# EAGLE design v3 (EAGLE 7.7.0)
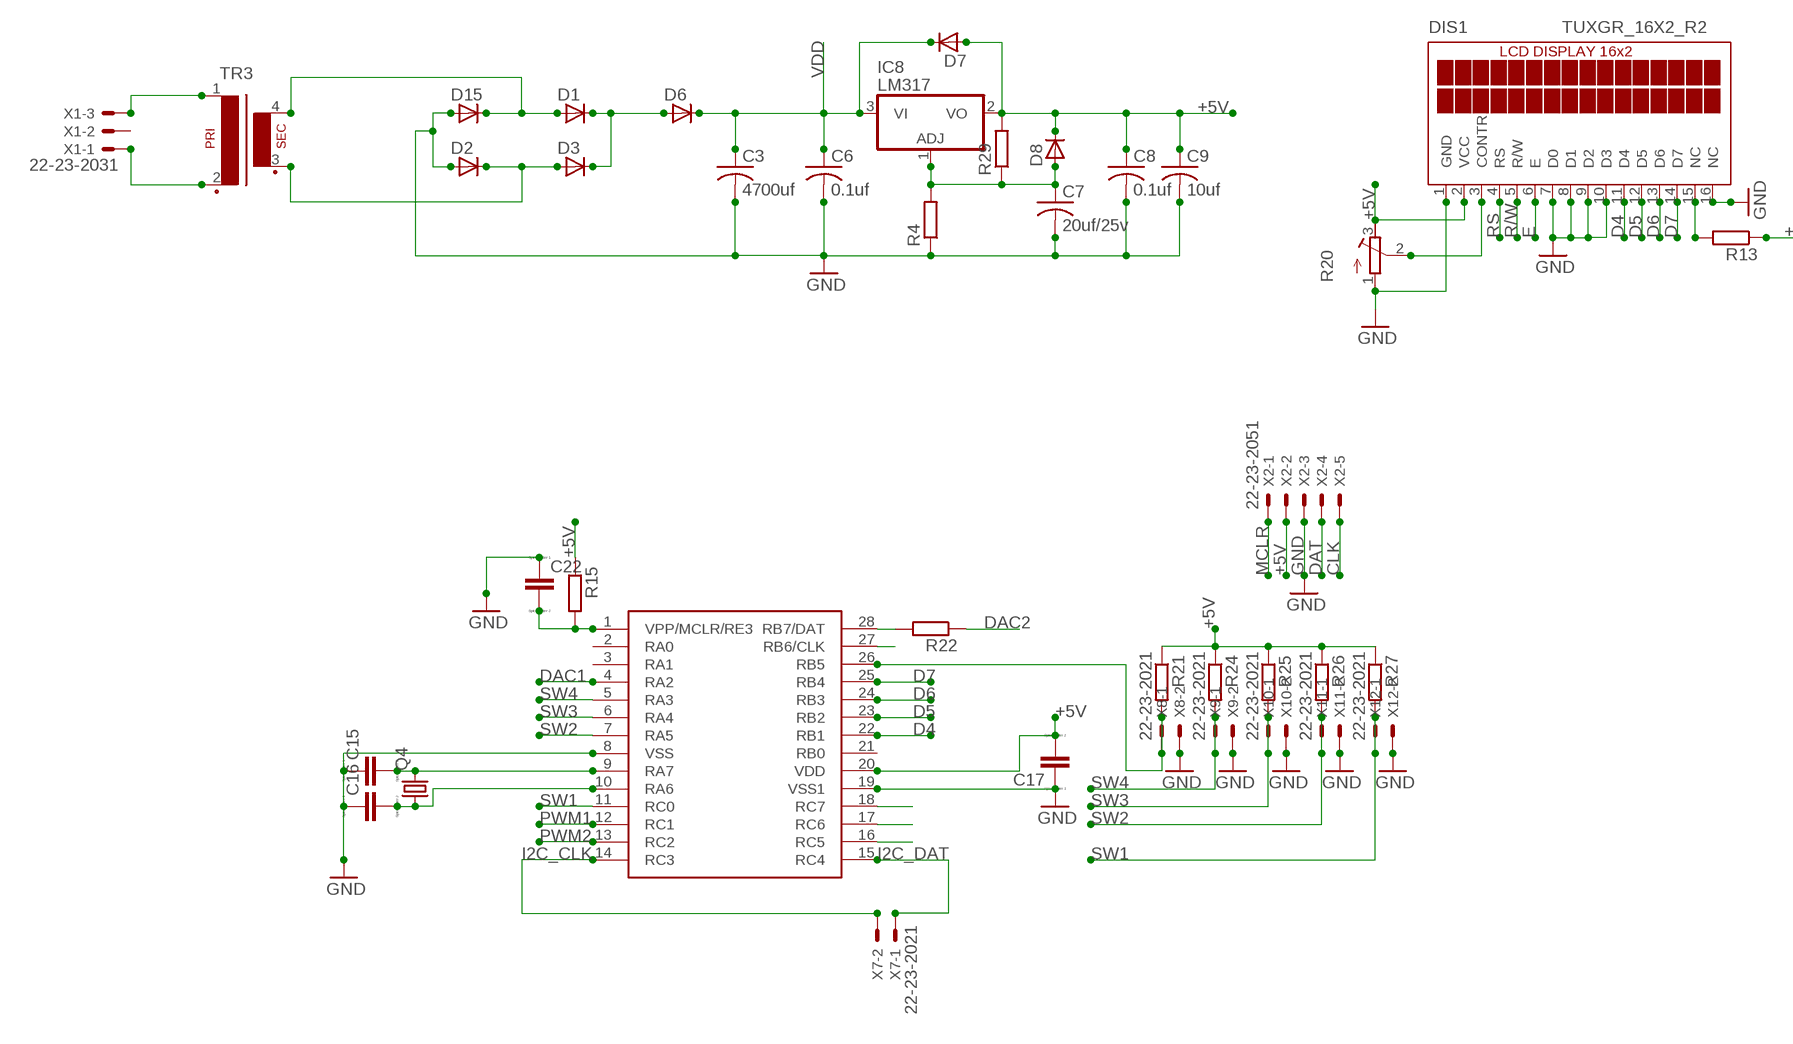
[diagram p0: schematic, sheet 1, part 1 of 2]
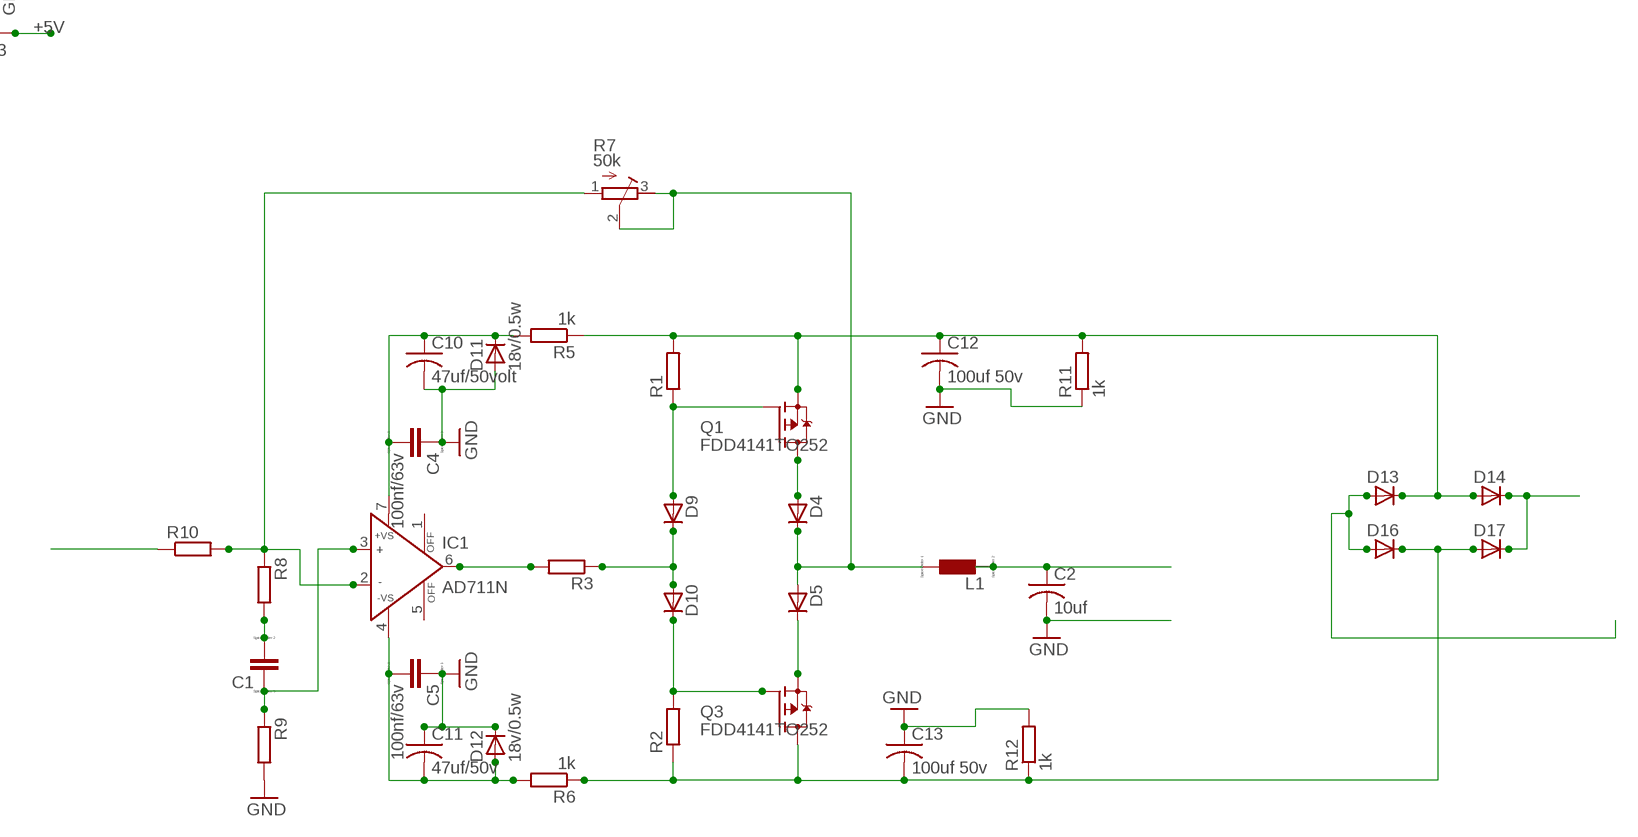
[diagram p1: schematic, sheet 1, part 2 of 2]

## Parts
C1  CC0603  [C0603]
C2  10uf  C-US025-025X050  [C025-025X050]
C3  4700uf  C-US025-025X050  [C025-025X050]
C4  100nf/63v  CC0603  [C0603]
C5  100nf/63v  CC0603  [C0603]
C6  0.1uf  C-US025-025X050  [C025-025X050]
C7  20uf/25v  C-US025-025X050  [C025-025X050]
C8  0.1uf  C-US025-025X050  [C025-025X050]
C9  10uf  C-US025-025X050  [C025-025X050]
C10  47uf/50volt  C-US025-025X050  [C025-025X050]
C11  47uf/50v  C-US025-025X050  [C025-025X050]
C12  100uf 50v  C-US025-025X050  [C025-025X050]
C13  100uf 50v  C-US025-025X050  [C025-025X050]
C15  CC0603  [C0603]
C16  CC0603  [C0603]
C17  CC0603  [C0603]
C22  CC0603  [C0603]
D1  D-SOD-87  [SOD87]
D2  D-SOD-87  [SOD87]
D3  D-SOD-87  [SOD87]
D4  D-SOD-87  [SOD87]
D5  D-SOD-87  [SOD87]
D6  D-SOD-87  [SOD87]
D7  D-SOD-87  [SOD87]
D8  D-SOD-87  [SOD87]
D9  D-SOD-87  [SOD87]
D10  D-SOD-87  [SOD87]
D11  18v/0.5w  D-SOD-87  [SOD87]
D12  18v/0.5w  D-SOD-87  [SOD87]
D13  D-SOD-87  [SOD87]
D14  D-SOD-87  [SOD87]
D15  D-SOD-87  [SOD87]
D16  D-SOD-87  [SOD87]
D17  D-SOD-87  [SOD87]
DIS1  TUXGR_16X2_R2  [TUXGR_16X2_R2]
IC1  AD711N  [DIL08]
IC8  LM317  78L05Z  [TO92]
L1  L0204/7  [0204/7]
Q1  FDD4141TO252  [TO252]
Q3  FDD4141TO252  [TO252]
Q4  CRYSTALHC49U-V  [HC49U-V]
R1  R-EU_R0603  [R0603]
R2  R-EU_R0603  [R0603]
R3  R-EU_R0603  [R0603]
R4  R-EU_R0603  [R0603]
R5  1k  R-EU_R0603  [R0603]
R6  1k  R-EU_R0603  [R0603]
R7  50k  R-TRIMM64X  [RTRIM64X]
R8  R-EU_R0603  [R0603]
R9  R-EU_R0603  [R0603]
R10  R-EU_R0603  [R0603]
R11  1k  R-EU_R0603  [R0603]
R12  1k  R-EU_R0603  [R0603]
R13  R-EU_R0603  [R0603]
R15  R-EU_R0603  [R0603]
R20  R-TRIMM64X  [RTRIM64X]
R21  R-EU_R0603  [R0603]
R22  R-EU_R0603  [R0603]
R24  R-EU_R0603  [R0603]
R25  R-EU_R0603  [R0603]
R26  R-EU_R0603  [R0603]
R27  R-EU_R0603  [R0603]
R29  R-EU_R0603  [R0603]
TR3  VR13-1  [VR13-1]
U$1  PIC16F15345  [SO28W]
X1  22-23-2031  [22-23-2031]
X2  22-23-2051  [22-23-2051]
X7  22-23-2021  [22-23-2021]
X8  22-23-2021  [22-23-2021]
X9  22-23-2021  [22-23-2021]
X10  22-23-2021  [22-23-2021]
X11  22-23-2021  [22-23-2021]
X12  22-23-2021  [22-23-2021]

## Nets
+5V: C8.1 C9.1 C17.2 D7.2(A) D8.1(C) DIS1.2(VCC) IC8.2(VO) R13.1 R15.1 R20.3(E) R21.1 R24.1 R25.1 R26.1 R27.1 R29.2 U$1.20(VDD) X2.2
CLK: U$1.27(RB6/CLK) X2.5
D4: DIS1.11(D4) U$1.22(RB1)
D5: DIS1.12(D5) U$1.23(RB2)
D6: DIS1.13(D6) U$1.24(RB3)
D7: DIS1.14(D7) U$1.25(RB4)
DAC1: U$1.4(RA2)
DAC2: R22.1
DAT: R22.2 U$1.28(RB7/DAT) X2.4
E: DIS1.6(E) U$1.18(RC7)
GND: C2.2 C3.2 C4.1 C5.1 C6.2 C7.2 C8.2 C9.2 C10.2 C11.1 C12.2 C13.1 C15.1 C16.1 C17.1 C22.1 D2.2(A) D11.2(A) D12.1(C) D15.2(A) DIS1.1(GND) DIS1.7(D0) DIS1.8(D1) DIS1.9(D2) DIS1.10(D3) DIS1.16(NC) R4.1 R9.2 R11.1 R12.2 R20.1(A) U$1.8(VSS) U$1.19(VSS1) X2.3 X8.2 X9.2 X10.2 X11.2 X12.2
GND1: D13.2(A) D16.2(A)
I2C_CLK: U$1.14(RC3) X7.2
I2C_DAT: U$1.15(RC4) X7.1
MCLR: C22.2 R15.2 U$1.1(VPP/MCLR/RE3) X2.1
N$1: D4.1(C) D5.2(A) L1.1 R7.2(S) R7.3(E)
N$2: D4.2(A) Q1.3(D)
N$3: D1.1(C) D3.1(C) D6.2(A)
N$4: D1.2(A) D15.1(C) TR3.4(S4)
N$5: D2.1(C) D3.2(A) TR3.3(S3)
N$6: D5.1(C) Q3.2(S)
N$7: D9.1(C) D10.2(A) R3.1
N$8: DIS1.15(NC) R13.2
N$9: D10.1(C) Q3.1(G) R2.2
N$10: C7.1 D8.2(A) IC8.1(ADJ) R4.2 R29.1
N$11: R21.2 U$1.26(RB5) X8.1
N$12: D9.2(A) Q1.1(G) R1.1
N$15: IC1.6(OUT) R3.2
N$16: C5.2 C11.2 D12.2(A) IC1.4(-VS) R6.2
N$17: C4.2 C10.1 D11.1(C) IC1.7(+VS) R5.2
N$18: DIS1.3(CONTR) R20.2(S)
N$20: C1.2 R8.2
N$21: R10.1
N$22: IC1.2(IN-) R7.1(A) R8.1 R10.2
N$23: C1.1 IC1.3(IN+) R9.1
N$24: C2.1 L1.2
N$27: D14.1(C) D17.1(C)
N$28: C12.1 D13.1(C) D14.2(A) Q1.2(S) R1.2 R5.1 R11.2
N$29: TR3.1 X1.3
N$30: TR3.2 X1.1
N$31: C16.2 Q4.1 U$1.10(RA6)
N$32: C15.2 Q4.2 U$1.9(RA7)
N$33: C13.2 D16.1(C) D17.2(A) Q3.3(D) R2.1 R6.1 R12.1
PWM1: U$1.12(RC1)
PWM2: U$1.13(RC2)
R/W: DIS1.5(R/W) U$1.17(RC6)
RS: DIS1.4(RS) U$1.16(RC5)
SW1: R27.2 U$1.11(RC0) X12.1
SW2: R26.2 U$1.7(RA5) X11.1
SW3: R25.2 U$1.6(RA4) X10.1
SW4: R24.2 U$1.5(RA3) X9.1
VDD: C3.1 C6.1 D6.1(C) D7.1(C) IC8.3(VI)
Unconnected: IC1.1(OFF) IC1.5(OFF) U$1.2(RA0) U$1.3(RA1) U$1.21(RB0) X1.2

## Library data of the parts
C1 C4 C5 C15-C17 C22 = eagle-ltspice:C: CAPACITOR, European symbol; SPICEMODEL: NONE; SPICEPREFIX: C
C2 C3 C6-C13 = rcl:C-US: CAPACITOR, American symbol
D1-D17 = semicon-smd-ipc:D-: DIODE unfilled
DIS1 = display-lcd:TUXGR_16X2_R2: Tuxgraphics LCD display 16x2 characters reflective, without background light Source: tuxgr_12x2_r2.pdf; OC_FARNELL: unknown; OC_NEWARK: unknown
IC1 = analog-devices:AD711: Precision, Low Cost, High Speed, BiFET Op Amp Source: http://www.analog.com/static/imported-files/data_sheets/AD711.pdf; MPN: AD711BQ; OC_FARNELL: 9604839; OC_NEWARK: 66F5826
IC8 = lm317:78*: Positive VOLTAGE REGULATOR Source: http://cache.national.com/ds/LM/LM78L05.pdf http://www.fairchildsemi.com/ds/LM/LM7805.pdf
L1 = eagle-ltspice:L: INDUCTOR, European symbol; SPICEMODEL: NONE; SPICEPREFIX: L
Q1 Q3 = transistor-fet:FDD4141: P-Channel PowerTrench® MOSFET Source: FDD4141.pdf
Q4 = crystal:CRYSTAL: CRYSTAL; OC_FARNELL: 1666969; OC_NEWARK: unknown
R1-R6 R8-R13 R15 R21 R22 R24-R27 R29 = rcl:R-EU_: RESISTOR, European symbol
R7 R20 = rcl:R-TRIMM: Trimm resistor
TR3 = trafo:VR13-1: TRANSFORMER 1 primary winding, 1 secondary winding, mounting holes BLOCK
U$1 = microchip:PIC16F15345
X1 = con-molex:22-23-2031: .100" (2.54mm) Center Header - 3 Pin; MF: MOLEX; MPN: 22-23-2031; OC_FARNELL: 1462950; OC_NEWARK: 30C0862
X2 = con-molex:22-23-2051: .100" (2.54mm) Center Header - 5 Pin; MF: MOLEX; MPN: 22-23-2051; OC_FARNELL: 1462952; OC_NEWARK: 38C9178
X7-X12 = con-molex:22-23-2021: .100" (2.54mm) Center Header - 2 Pin; MF: MOLEX; MPN: 22-23-2021; OC_FARNELL: 1462926; OC_NEWARK: 25C3832

## Board
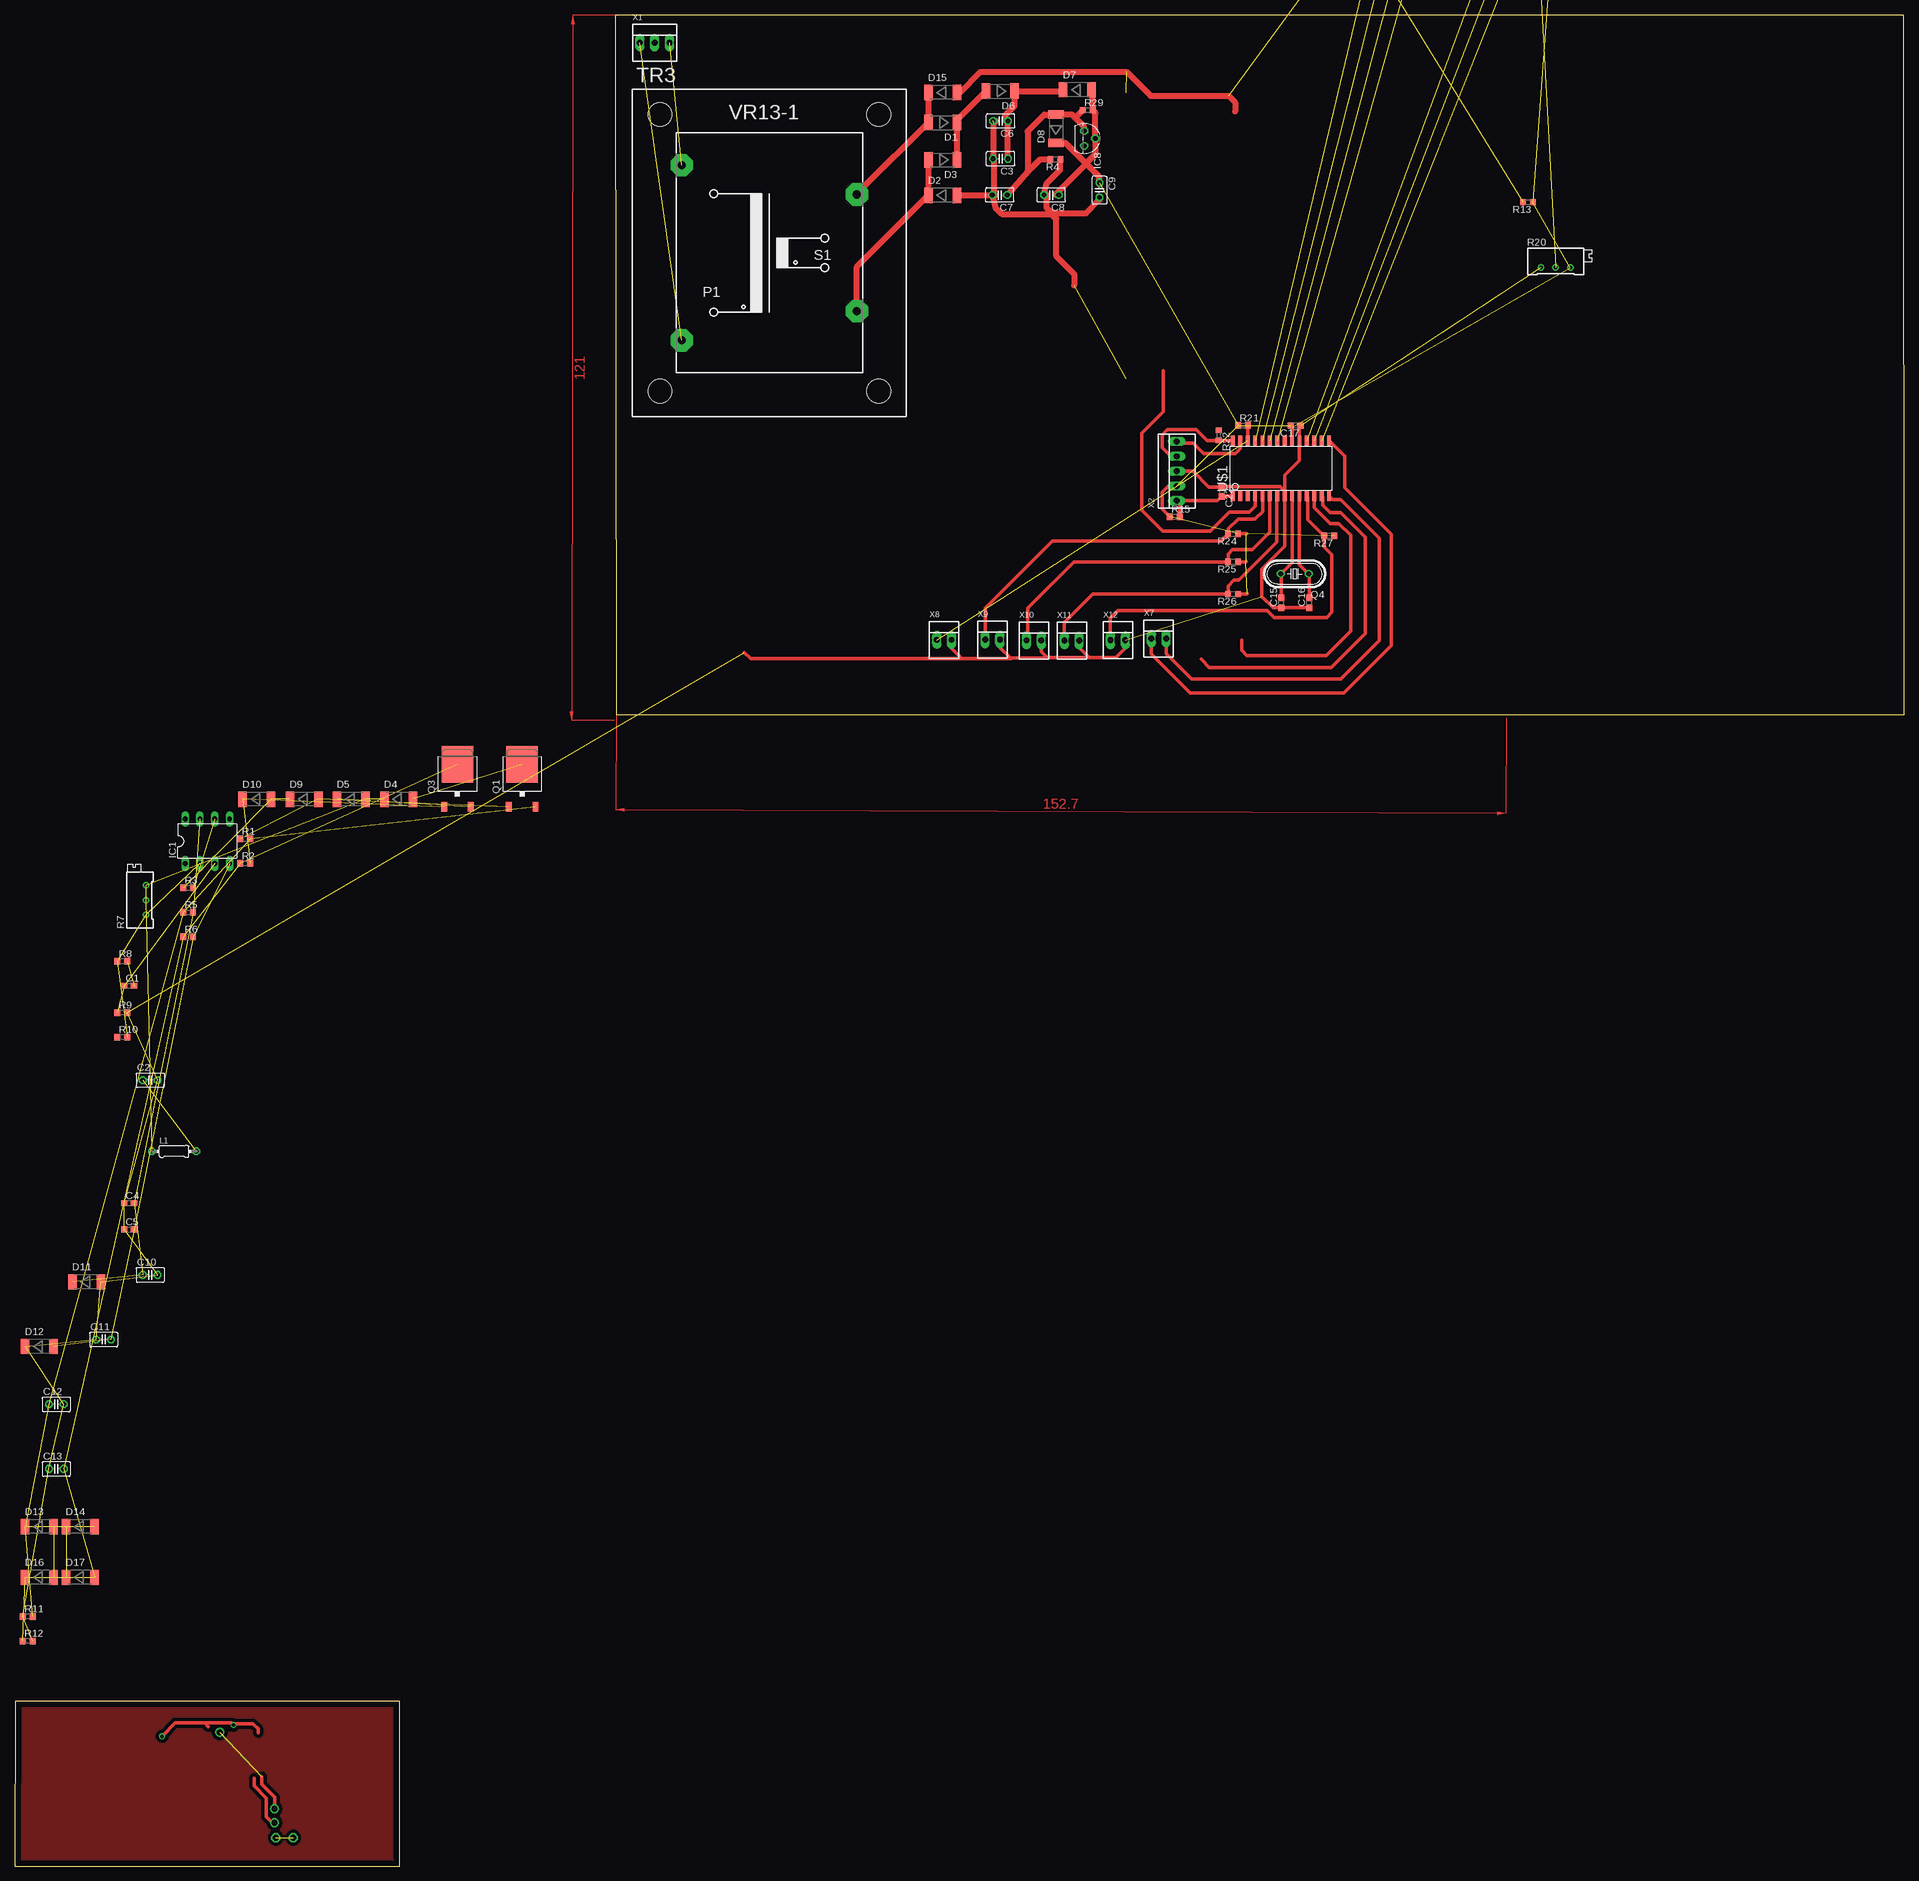
[diagram p2: board, top side]
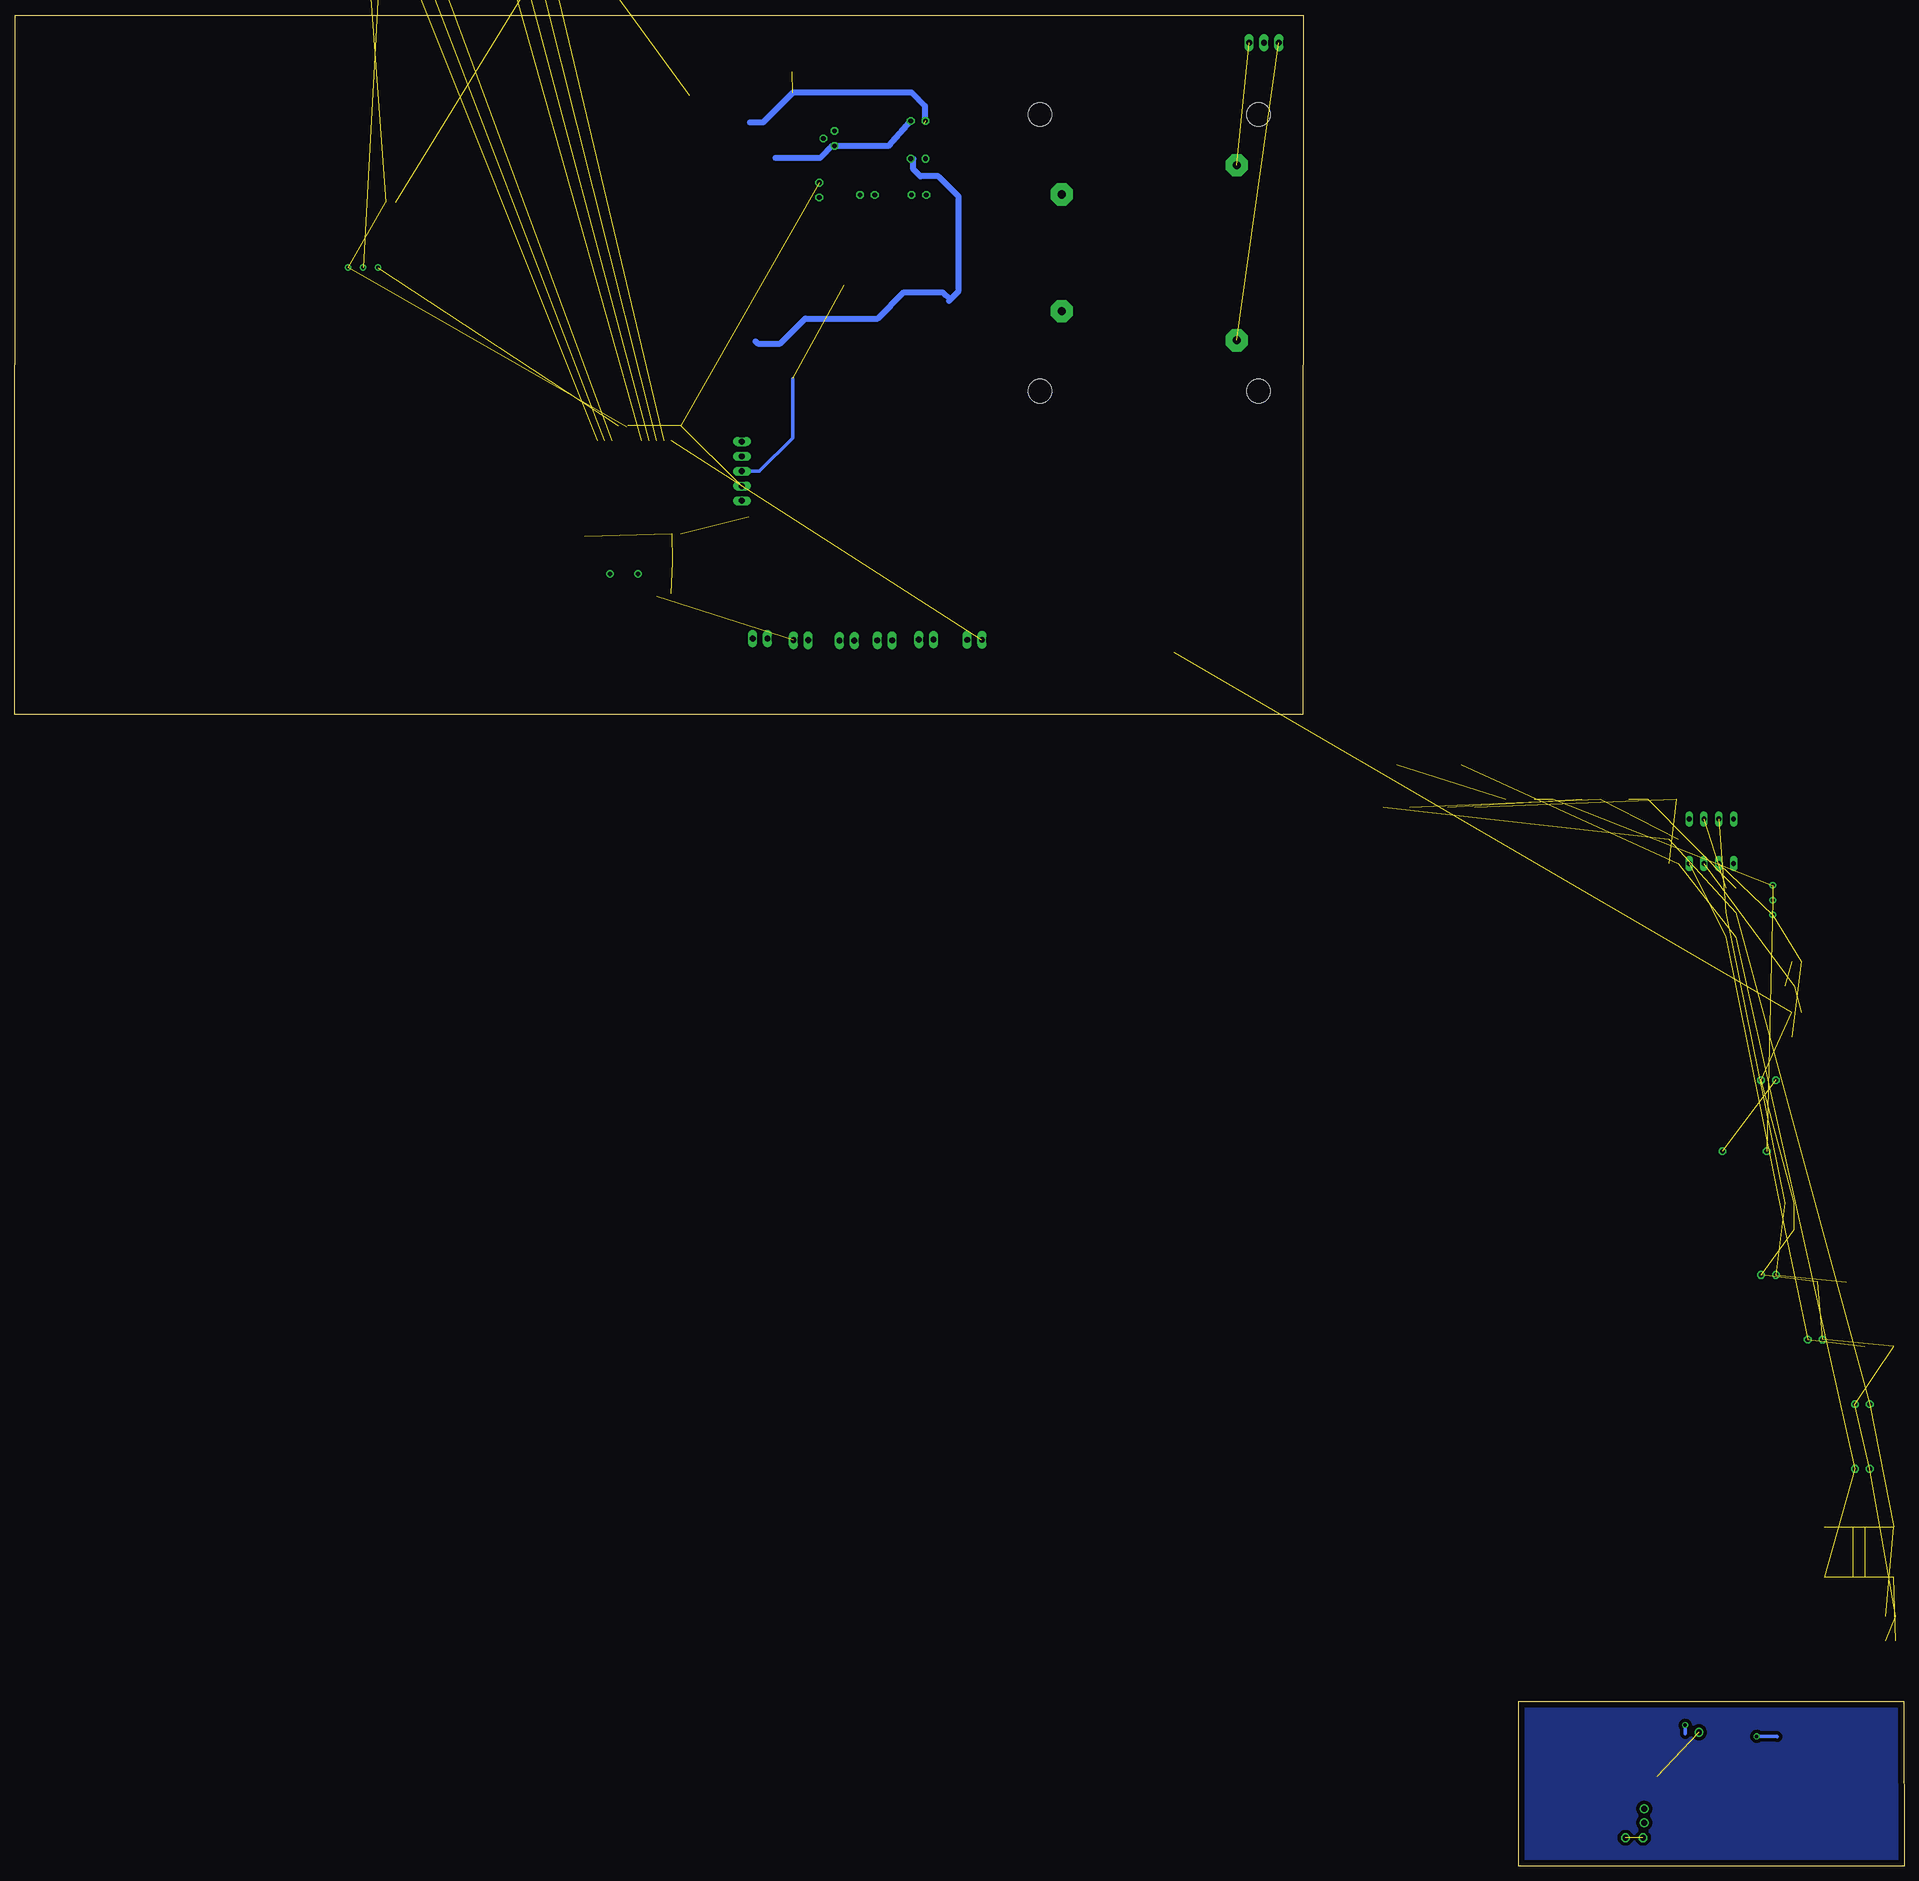
[diagram p3: board, bottom side, seen from below]

Size 324.13 x 317.6 mm. Coordinates in mm from the lower left corner, seen from the top.
Outline: 103.17,197.6 324.13,197.6 324.03,317.6 103.07,317.6 103.17,197.6
Outline: 0,0.06 66.1,0 66.1,28.3 0.1,28.3 0,0.06
Copper layers (1*16): Top 0.035mm / dielectric 1.5mm / Bottom 0.035mm
Design rules "default": minimum track width 10mil, minimum drill 24mil, track to track 8mil, track to pad 8mil, pad to pad 8mil, via to via 8mil, smd to smd 8mil, copper to edge 40mil, drill to drill 8mil, minimum pad ring 10mil, minimum via ring 8mil, stop-mask expansion 4mil, vias tented up to drill 0mil, thermal gap 10mil

### Footprints (pad centres in the part's own frame; a part is rotated, then mirrored left to right if it is on the bottom)
C0603 = smd 1.1 x 1: 1 -0.85,0; 2 0.85,0
C025-025X050 = drill 0.813 octagon: 1 -1.27,0; 2 1.27,0
SOD87 = smd 1.45 x 2.6: 1 -2.445,0; 2 2.445,0
TUXGR_16X2_R2 = drill 1 pad 1.676: 1 -32,15.5; 2 -29.46,15.5; 3 -26.92,15.5; 4 -24.38,15.5; 5 -21.84,15.5; 6 -19.3,15.5; 7 -16.76,15.5; 8 -14.22,15.5; 9 -11.68,15.5; 10 -9.14,15.5; 11 -6.6,15.5; 12 -4.06,15.5; 13 -1.52,15.5; 14 1.02,15.5; 15 3.56,15.5; 16 6.1,15.5 | hole 2.5: -37.5,-15.5; 37.5,-15.5; -37.5,15.5; 37.5,15.5
DIL08 = drill 0.813 long: 1 -3.81,-3.81; 2 -1.27,-3.81; 3 1.27,-3.81; 4 3.81,-3.81; 5 3.81,3.81; 6 1.27,3.81; 7 -1.27,3.81; 8 -3.81,3.81
TO92 = drill 0.813 octagon: 1 -1.27,0; 2 0,1.905; 3 1.27,0
0204/7 = drill 0.813 octagon: 1 -3.81,0; 2 3.81,0
TO252 = smd 1 x 1.6: 1 -2.28,-4.8; 2 2.28,-4.8 | smd 5.4 x 6.2: 3 0,2.5
HC49U-V = drill 0.813: 1 -2.413,0; 2 2.413,0
R0603 = smd 1 x 1.1: 1 -0.85,0; 2 0.85,0
RTRIM64X = drill 0.61: 1 1.27,-2.54; 2 1.27,0; 3 1.27,2.54
VR13-1 = drill 1.397 pad 3.81 octagon: 1 -15.011,15.011; 2 -15.011,-15.011; 3 15.011,-10.008; 4 15.011,10.008 | hole 4.115: -18.745,-23.749; 18.745,-23.749; 18.745,23.749; -18.745,23.749
SO28W = smd 0.65 x 1.7: 1 -7.62,-4.78; 2 -6.35,-4.78; 3 -5.08,-4.78; 4 -3.81,-4.78; 5 -2.54,-4.78; 6 -1.27,-4.78; 7 0,-4.78; 8 1.27,-4.78; 9 2.54,-4.78; 10 3.81,-4.78; 11 5.08,-4.78; 12 6.35,-4.78; 13 7.62,-4.78; 14 8.89,-4.78; 15 8.89,4.78; 16 7.62,4.78; 17 6.35,4.78; 18 5.08,4.78; 19 3.81,4.78; 20 2.54,4.78; 21 1.27,4.78; 22 0,4.78; 23 -1.27,4.78; 24 -2.54,4.78; 25 -3.81,4.78; 26 -5.08,4.78; 27 -6.35,4.78; 28 -7.62,4.78
22-23-2031 = drill 1 long: 1 -2.54,0; 2 0,0; 3 2.54,0
22-23-2051 = drill 1 long: 1 -5.08,0; 2 -2.54,0; 3 0,0; 4 2.54,0; 5 5.08,0
22-23-2021 = drill 1 long: 1 -1.27,0; 2 1.27,0

### Placement (x,y rotation side)
C1  19.67,151.1 0 top
C2  23.27,134.9 0 top
C3  169.13,293 180 top
C4  19.67,113.8 0 top
C5  19.67,109.3 0 top
C6  169.13,299.49 180 top
C7  169,286.78 180 top
C8  177.85,286.78 180 top
C9  186.1,287.62 270 top
C10  23.27,101.5 0 top
C11  15.27,90.4 0 top
C12  7.17,79.3 0 top
C13  7.17,68.2 0 top
C15  217.27,216.8 90 top
C16  222.07,216.8 90 top
C17  219.77,247.2 180 top
C22  207.07,235.9 270 top
D1  159.2,299.22 180 top
D2  159.2,286.72 0 top
D3  159.2,292.8 180 top
D4  65.87,183.1 0 top
D5  57.77,183.1 0 top
D6  169.06,304.62 180 top
D7  182.32,304.82 0 top
D8  178.64,298.19 90 top
D9  49.67,183.1 0 top
D10  41.57,183.1 0 top
D11  12.37,100.3 0 top
D12  4.27,89.2 0 top
D13  4.27,58.3 0 top
D14  11.27,58.3 0 top
D15  159.2,304.37 0 top
D16  4.27,49.6 0 top
D17  11.27,49.6 0 top
DIS1  234.35,346.64 180 top  (outside the outline)
IC1  33.07,175.9 0 top
IC8  183.49,296.49 270 top
L1  27.37,122.7 0 top
Q1  87.07,186.6 0 top
Q3  75.97,186.6 0 top
Q4  219.6,221.77 180 top
R1  39.57,176.3 0 top
R2  39.57,172.1 0 top
R3  29.77,167.9 0 top
R4  178.56,292.87 180 top
R5  29.77,163.7 0 top
R6  29.77,159.5 0 top
R7  21.27,165.8 0 top
R8  18.47,155.3 0 top
R9  18.47,146.5 0 top
R10  18.47,142.3 0 top
R11  2.27,42.9 0 top
R12  2.27,38.7 0 top
R13  259.61,285.55 180 top
R15  199.03,231.57 0 top
R20  264.36,275.59 270 top
R21  210.73,247.23 0 top
R22  206.56,245.54 270 top
R24  209.01,228.65 180 top
R25  209.01,223.83 180 top
R26  209.01,218.31 180 top
R27  225.51,228.29 180 top
R29  184.09,301.33 0 top
TR3  129.48,276.86 0 top
U$1  216.6,239.88 0 top
X1  109.81,312.9 0 top
X2  199.37,239.4 90 top
X7  196.26,210.69 0 top
X8  159.46,210.45 0 top
X9  167.76,210.51 0 top
X10  174.86,210.37 0 top
X11  181.36,210.33 0 top
X12  189.26,210.39 0 top

### Tracks (layer width: path | path; a pad name or v marks a point on that pad's centre or on a via)
+5V  (10 unrouted)
  Top 0.61: U$1.20 219.14,246.98 C17.2 | X2.2 197.93,236.86 196.87,235.8 196.87,232.88 R15.1 | R24.1 211.32,228.65 211.37,228.7 | R25.1 211.2,223.83 211.27,223.9 | R26.1 211.38,218.31 211.47,218.4
  Top 1.016: D7.2 184.94,304.64 R29.2 185.39,300.88 IC8.2 185.47,296.42 185.47,293.9 184.01,292.44 183.57,292.44 | 178.54,286.87 C8.1 178.62,286.96 183.84,292.17 | C9.1 186.09,289.92 183.84,292.17 | 183.84,292.17 183.57,292.44 | D8.1 180.27,295.75 183.57,292.44
CLK
  Top 0.61: U$1.27 210.25,243.28 209.37,242.4 203.97,242.4 202.17,244.2 199.65,244.2 X2.5
D4  (1 unrouted)
D5  (1 unrouted)
D6  (1 unrouted)
D7  (1 unrouted)
DAC1
  Top 0.61: U$1.4 212.79,233.42 211.77,232.4 208.37,232.4 205.07,229.1 196.97,229.1 193.37,232.7 193.37,245.9 197.07,249.6 197.07,256.66
DAT
  Top 0.61: U$1.28 207.11,244.66 R22.2 206.47,244.6 204.57,244.6 202.67,246.5 197.77,246.5 196.87,245.6 196.87,243.4 198.33,241.94 X2.4
E  (1 unrouted)
GND  (23 unrouted)
  Top 0.61: X2.3 202.17,239.4 204.87,236.7 207.02,236.7 C22.1 217.12,236.75 217.82,236.05 | 217.82,236.05 217.87,236 U$1.8 217.87,226.5 213.97,222.6 213.97,217.9 215.92,215.95 C15.1 C16.1 | C17.1 220.41,246.99 U$1.19 220.41,241.24 217.87,238.7 217.87,236.1 217.82,236.05 | X12.2 190.53,209.06 188.87,207.4 184.37,207.4 184.12,207.65 | 184.12,207.65 182.67,209.1 182.67,210.29 X11.2 | X10.2 176.13,208.44 177.17,207.4 | 177.17,207.4 183.87,207.4 184.12,207.65 | X9.2 169.03,209.14 170.87,207.3 | 170.87,207.3 171.07,207.3 | 171.07,207.3 177.07,207.3 177.17,207.4 | X8.2 160.73,208.94 162.47,207.2 | 170.77,207.2 170.87,207.3 | 162.47,207.2 126.27,207.2 125.17,208.3 | 162.47,207.2 170.97,207.2 171.07,207.3
  Top 1.016: 168,292.62 C3.2 | 168,292.62 168,299.13 168.37,299.5 | 168,292.62 168,287.02 C7.2 | C9.2 186.1,285.94 183.77,283.6 177.97,283.6 | 177.97,283.6 177.07,284.5 177.07,286.75 C8.2 177.09,288.82 179.37,291.1 179.37,292.83 R4.1 | C7.2 168.24,284.63 169.37,283.5 177.87,283.5 | 177.87,283.5 177.97,283.6 | 181.77,271.31 181.77,273.2 178.71,276.26 178.71,282.66 177.87,283.5 | D2.2 168.19,286.72 C7.2 | D15.2 162.14,304.37 165.67,307.9 190.77,307.9 194.87,303.8 208.27,303.8 209.37,302.7 209.37,301.13
  Bottom 0.61: X2.3 196.37,239.4 190.67,245.1 190.67,255.28
  Bottom 1.016: C6.2 167.97,299.88 167.97,302.1 170.17,304.3 190.67,304.3 195.77,299.2 197.96,299.2
GND1  (1 unrouted)
I2C_CLK
  Top 0.61: X7.2 197.53,208.14 201.97,203.7 227.47,203.7 234.07,210.3 234.07,227.9 227.47,234.5 226.09,234.5 U$1.14
I2C_DAT
  Top 0.61: X7.1 194.99,207.98 201.67,201.3 227.97,201.3 236.17,209.5 236.17,228.6 228.17,236.6 228.17,241.98 U$1.15
MCLR
  Top 0.61: U$1.1 207.12,235.1 C22.2 206.34,234.32 X2.1 199.88,233.81 R15.2
N$1  (4 unrouted)
N$2  (1 unrouted)
N$3
  Top 1.016: 166.51,304.52 D6.2 161.64,299.65 D1.1 D3.1
N$4
  Top 1.016: TR3.4 145.45,286.87 145.45,287.92 D1.2 D15.1
N$5
  Top 1.016: D3.2 D2.1 144.49,274.46 TR3.3
N$6  (1 unrouted)
N$7  (2 unrouted)
N$8  (1 unrouted)
N$9  (2 unrouted)
N$10
  Top 1.016: 181.94,300.03 R29.1 | IC8.1 183.49,298.48 181.94,300.03 | 173.77,290.78 173.77,297.7 176.67,300.6 178.6,300.6 D8.2 181.33,300.63 181.94,300.03 | 173.77,290.78 C7.1 | R4.2 175.86,292.87 173.77,290.78
N$11  (1 unrouted)
  Top 0.61: U$1.26 211.52,247.17 R21.2
N$12  (2 unrouted)
N$15  (1 unrouted)
N$16  (4 unrouted)
N$17  (4 unrouted)
N$18  (1 unrouted)
N$20  (1 unrouted)
N$22  (3 unrouted)
N$23  (2 unrouted)
N$24  (1 unrouted)
N$27  (1 unrouted)
N$28  (6 unrouted)
N$29  (1 unrouted)
N$30  (1 unrouted)
N$31
  Top 0.61: U$1.10 220.41,223.37 Q4.1 222.07,221.71 C16.2
N$32
  Top 0.61: U$1.9 219.14,223.72 Q4.2 217.27,221.69 C15.2
N$33  (6 unrouted)
N$39  (via drill 1)
  Top 0.61: v44.6,7.5 44.2,7.5 43.2,8.5 43.2,11.7 41.1,13.8 41.1,15.1
N$40  (via drill 1)  (1 unrouted)
  Top 0.61: 42.4,15.4 42.4,14.1 44.6,11.9 v44.6,9.9
  other vias: 35.2,23
N$41
  pour Bottom (isolate 0.61): 0.1,28.3 66.1,28.3 66.1,0.1 0.1,0.1
N$42
  pour Top (isolate 0.61): 0.2,28.3 66.1,28.3 66.1,0.1 0.2,0.1
N$43  (via drill 1)  (1 unrouted)
  other vias: 44.8,4.9 47.8,4.9
PWM1
  Top 0.61: U$1.12 222.95,233.12 225.67,230.4 227.17,230.4 229.17,228.4 229.17,212 224.97,207.8 211.37,207.8 210.47,208.7 210.47,210.41
PWM2
  Top 0.61: 203.53,207.14 204.97,205.7 225.87,205.7 231.67,211.5 231.67,228.1 227.47,232.3 225.67,232.3 224.37,233.6 224.37,234.95 U$1.13
R/W  (1 unrouted)
RS  (1 unrouted)
SW1
  Top 0.61: U$1.11 221.86,234.92 221.86,231.09 R27.2 224.66,226.41 225.97,225.1 225.97,215.2 225.07,214.3 216.07,214.3 214.87,215.5 189.27,215.5 187.99,214.22 X12.1
SW2
  Top 0.61: U$1.7 216.47,234.97 216.47,227.2 209.97,220.7 209.17,220.7 208.16,219.69 R26.2 184.98,218.31 180.07,213.4 180.07,210.35 X11.1
SW3
  Top 0.61: U$1.6 215.27,235.04 215.27,228.9 212.27,225.9 208.87,225.9 208.16,225.19 R25.2 181.7,223.83 173.77,215.9 173.77,210.55 X10.1
SW4
  Top 0.61: U$1.5 214.07,232.5 212.77,231.2 209.87,231.2 208.17,229.5 R24.2 206.91,227.4 177.97,227.4 166.49,215.92 X9.1
VCC  (via drill 0.6)
  Top 0.61: 41.8,22.95 41.8,23.6 40.9,24.5 37.8,24.5 v37.55,24.25 v37.54,24.25 37.2,24.6 32.6,24.6 | v25.3,22.3 27.6,24.6 32.6,24.6 | 33.24,23.96 32.6,24.6
  Bottom 0.61: v25.3,22.3 21.81,22.3 21.75,22.24 | 37.55,22.75 v37.55,24.25
VDD
  Top 1.016: C3.1 C6.1 169.87,299.53 169.87,300.4 171.5,302.04 D6.1 179.67,304.62 D7.1
  Bottom 1.016: C6.1 174.18,295.22 IC8.3 183.85,295.22 185.97,293.1 193.62,293.1 | 197.04,261.67 196.67,261.3 192.77,261.3 188.47,265.6 176.07,265.6 171.57,270.1 164.97,270.1 163.67,268.8 | 163.85,268.62 163.67,268.8 | 163.67,268.8 162.17,270.3 162.17,286.5 165.67,290 168.77,290 169.97,291.2 169.97,292.94 C3.1
(copper drawn outside any net)
  shapes: Top area x2